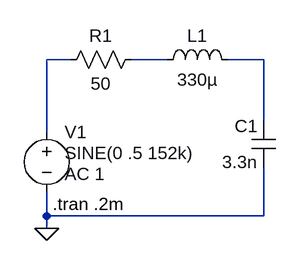
[diagram p0: schematic LC.asc]
LC.asc, the LTspice schematic file:
Version 4
SHEET 1 880 680
WIRE -2592 80 -2624 80
WIRE -2464 80 -2512 80
WIRE -2336 80 -2384 80
WIRE -2336 160 -2336 80
WIRE -2624 176 -2624 80
WIRE -2624 288 -2624 256
WIRE -2336 288 -2336 224
WIRE -2336 288 -2624 288
WIRE -2624 304 -2624 288
FLAG -2624 304 0
SYMBOL voltage -2624 160 R0
WINDOW 3 24 44 Left 2
WINDOW 123 24 72 Left 2
SYMATTR Value SINE(0 .5 152k)
SYMATTR Value2 AC 1
SYMATTR SpiceLine Rser=0
SYMATTR InstName V1
SYMBOL res -2608 96 R270
WINDOW 0 32 56 VTop 2
WINDOW 3 0 56 VBottom 2
SYMATTR InstName R1
SYMATTR Value 50
SYMBOL ind -2480 96 R270
WINDOW 0 32 56 VTop 2
WINDOW 3 5 56 VBottom 2
SYMATTR InstName L1
SYMATTR Value 330µ
SYMATTR SpiceLine Rser=0
SYMBOL cap -2320 224 R180
WINDOW 0 24 56 Left 2
WINDOW 3 24 8 Left 2
SYMATTR InstName C1
SYMATTR Value 3.3n
TEXT -2616 272 Left 2 !.tran .2m

The netlist it stands for:
* LC.asc
V1 N001 0 SINE(0 .5 152k) AC 1 Rser=0
R1 N001 N002 50
L1 N002 N003 330µ Rser=0
C1 0 N003 3.3n
.tran .2m
.backanno
.end